# Altium schematic sheet LED_EN_Kian_V2_MANAGE.SchDoc
size A
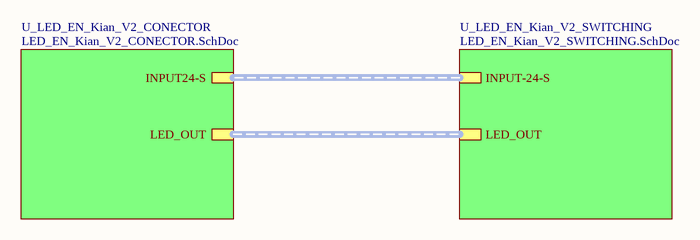
[diagram p0: LED_EN_Kian_V2_MANAGE.SchDoc]

## Sub-sheets
U_LED_EN_Kian_V2_CONECTOR = LED_EN_Kian_V2_CONECTOR.SchDoc: LED_OUT (harness LED_OUT), INPUT24-S (harness INPUT-24-S)
U_LED_EN_Kian_V2_SWITCHING = LED_EN_Kian_V2_SWITCHING.SchDoc: INPUT-24-S (harness INPUT-24-S), LED_OUT (harness LED_OUT)

## Buses and harness runs
harness sheet U_LED_EN_Kian_V2_CONECTOR/INPUT24-S = sheet U_LED_EN_Kian_V2_SWITCHING/INPUT-24-S
harness sheet U_LED_EN_Kian_V2_CONECTOR/LED_OUT = sheet U_LED_EN_Kian_V2_SWITCHING/LED_OUT